# Altium schematic sheet Project_Information.SchDoc: =project_title
size Tabloid; CompanyName: Luxonis Holding; Organization: Luxonis Holding; Address1: 1925 Harmony Park Drive; Address2: Westminster, CO; Address3: 80234; Address4: United States; SheetNumber: 1; SheetTotal: 5
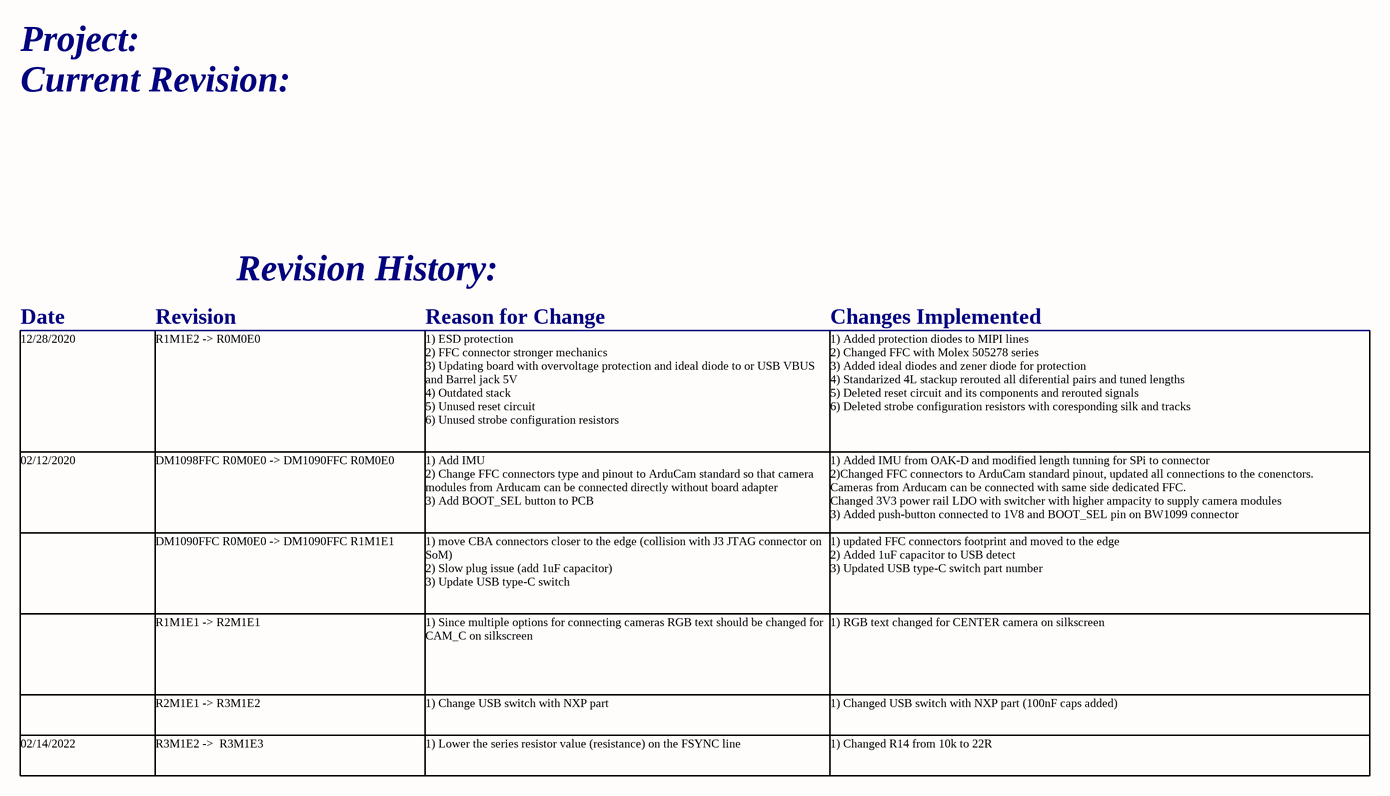
[diagram p0: Project_Information.SchDoc]

## Notes on the sheet
- Project:
- Current Revision:
- Revision History:
- Date
- Revision
- Reason for Change
- Changes Implemented
- 12/28/2020
- R1M1E2 -> R0M0E0
- 1) ESD protection
  2) FFC connector stronger mechanics
  3) Updating board with overvoltage protection and ideal diode to or USB VBUS and Barrel jack 5V
  4) Outdated stack
  5) Unused reset circuit
  6) Unused strobe configuration resistors
- 1) Added protection diodes to MIPI lines
  2) Changed FFC with Molex 505278 series
  3) Added ideal diodes and zener diode for protection
  4) Standarized 4L stackup rerouted all diferential pairs and tuned lengths
  5) Deleted reset circuit and its components and rerouted signals
  6) Deleted strobe configuration resistors with coresponding silk and tracks
- 02/12/2020
- DM1098FFC R0M0E0 -> DM1090FFC R0M0E0
- 1) Add IMU
  2) Change FFC connectors type and pinout to ArduCam standard so that camera modules from Arducam can be connected directly without board adapter
  3) Add BOOT_SEL button to PCB
- 1) Added IMU from OAK-D and modified length tunning for SPi to connector
  2)Changed FFC connectors to ArduCam standard pinout, updated all connections to the conenctors.
  Cameras from Arducam can be connected with same side dedicated FFC.
  Changed 3V3 power rail LDO with switcher with higher ampacity to supply camera modules
  3) Added push-button connected to 1V8 and BOOT_SEL pin on BW1099 connector
- DM1090FFC R0M0E0 -> DM1090FFC R1M1E1
- 1) move CBA connectors closer to the edge (collision with J3 JTAG connector on SoM)
  2) Slow plug issue (add 1uF capacitor)
  3) Update USB type-C switch
- 1) updated FFC connectors footprint and moved to the edge
  2) Added 1uF capacitor to USB detect
  3) Updated USB type-C switch part number
- R1M1E1 -> R2M1E1
- 1) Since multiple options for connecting cameras RGB text should be changed for CAM_C on silkscreen
- 1) RGB text changed for CENTER camera on silkscreen
- 02/14/2022
- R2M1E1 -> R3M1E2
- R3M1E2 ->  R3M1E3
- 1) Change USB switch with NXP part
- 1) Lower the series resistor value (resistance) on the FSYNC line
- 1) Changed USB switch with NXP part (100nF caps added)
- 1) Changed R14 from 10k to 22R
- Title
- Size:
- Date:
- Tabloid
- Number:
- Time:
- Revision:
- Sheet
- of
- Drawn by: